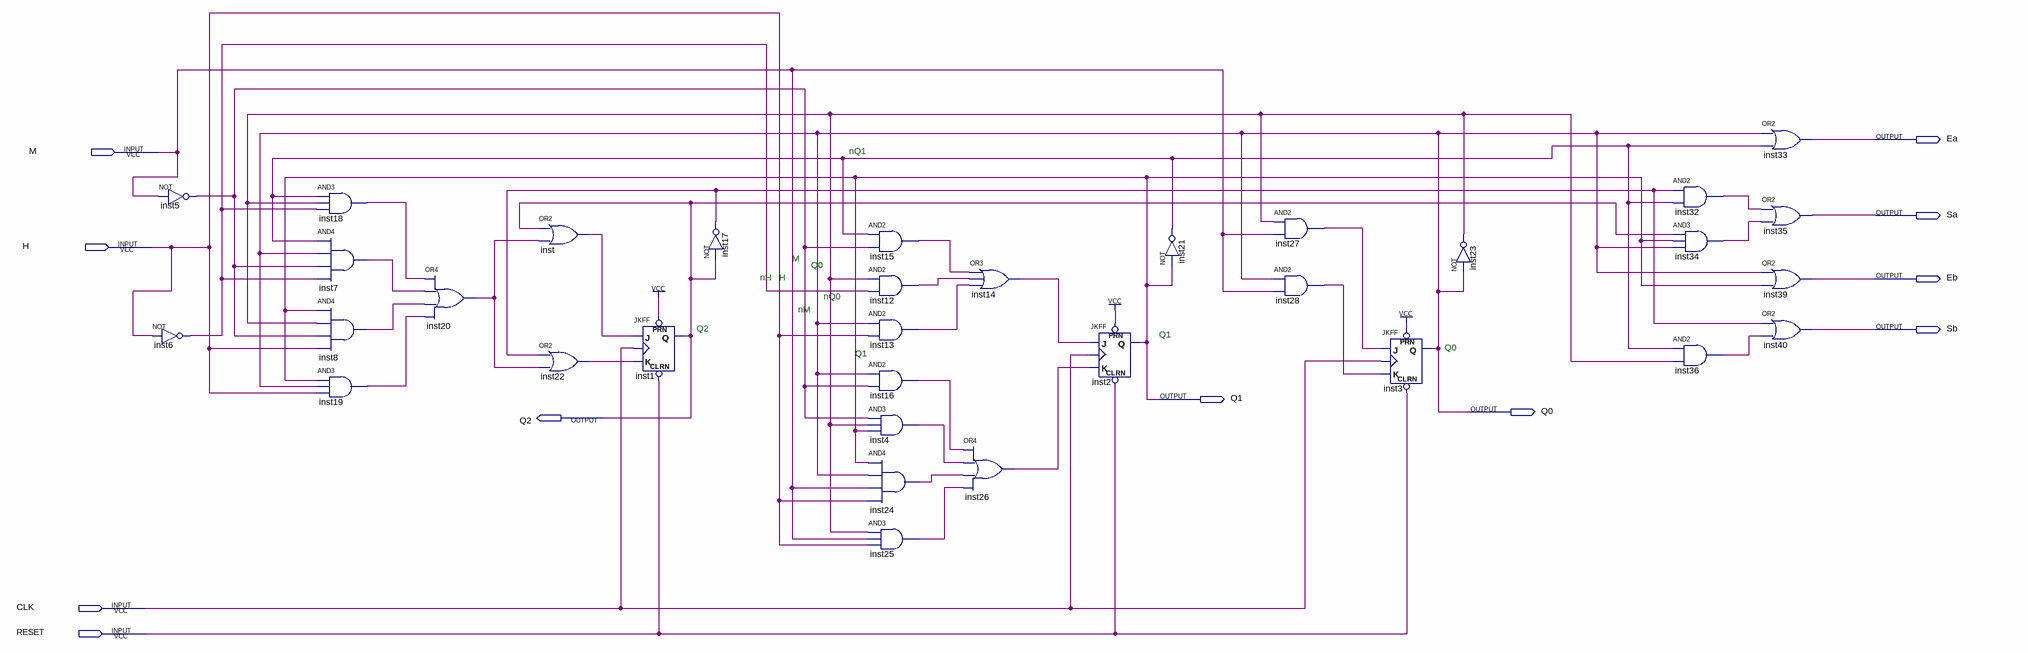
[diagram p0: schematic sheet]
// Quartus schematic CONTROLADOR_COMPLETO.bdf as structural Verilog: 33 symbols, 11 pins
module CONTROLADOR_COMPLETO (
  input  M,
  input  H,
  input  CLK,
  input  RESET,
  output Ea,
  output Sa,
  output Eb,
  output Sb,
  output Q1,
  output Q0,
  output Q2
);

  wire inst4_out, inst5_out, inst6_out, inst7_out, inst8_out, inst12_out, inst13_out, inst14_out, inst15_out,
       inst16_out, inst17_out, inst18_out, inst19_out, inst20_out, inst21_out, inst22_out, inst23_out,
       inst24_out, inst25_out, inst26_out, inst27_out, inst28_out, inst32_out, inst34_out, inst36_out,
       inst_out;

  not inst6 (inst6_out, H);
  not inst5 (inst5_out, M);
  and inst18 (inst18_out, inst21_out, inst23_out, inst6_out);
  and inst7 (inst7_out, inst21_out, Q0, inst5_out, inst6_out);
  and inst8 (inst8_out, Q1, inst23_out, inst5_out, H);
  and inst19 (inst19_out, Q1, Q0, H);
  or inst20 (inst20_out, inst18_out, inst7_out, inst8_out, inst19_out);
  or inst (inst_out, Q2, inst20_out);
  or inst22 (inst22_out, inst17_out, inst20_out);
  JKFF inst1 (.PRN(1'b1), .CLRN(RESET), .K(inst22_out), .J(inst_out), .CLK(CLK), .Q(Q2));
  not inst17 (inst17_out, Q2);
  and inst15 (inst15_out, inst21_out, inst5_out);
  and inst12 (inst12_out, inst23_out, inst6_out);
  and inst13 (inst13_out, Q0, H);
  and inst16 (inst16_out, Q0, inst5_out);
  and inst4 (inst4_out, inst5_out, inst23_out, Q1);
  and inst24 (inst24_out, Q1, Q0, M, H);
  and inst25 (inst25_out, inst23_out, M, H);
  or inst26 (inst26_out, inst16_out, inst4_out, inst24_out, inst25_out);
  or inst14 (inst14_out, inst15_out, inst12_out, inst13_out);
  JKFF inst2 (.PRN(1'b1), .CLRN(RESET), .K(inst26_out), .J(inst14_out), .CLK(CLK), .Q(Q1));
  not inst21 (inst21_out, Q1);
  and inst27 (inst27_out, inst23_out, M);
  and inst28 (inst28_out, Q0, M);
  JKFF inst3 (.PRN(1'b1), .CLRN(RESET), .K(inst28_out), .J(inst27_out), .CLK(CLK), .Q(Q0));
  not inst23 (inst23_out, Q0);
  and inst32 (inst32_out, inst17_out, inst21_out);
  and inst34 (inst34_out, Q2, Q1, Q0);
  and inst36 (inst36_out, inst21_out, inst23_out);
  or inst33 (Ea, Q0, inst21_out);
  or inst35 (Sa, inst32_out, inst34_out);
  or inst39 (Eb, Q0, Q1);
  or inst40 (Sb, inst17_out, inst36_out);

  // Notes on the sheet:
  //   nQ1
  //   M
  //   Q0
  //   nH
  //   H
  //   nQ0
  //   nM
  //   Q2
  //   Q1
  //   Q0
  //   Q1
endmodule
